# EAGLE schematic Addon-LAN-WLAN-without-MAPLE-V01-001 (EAGLE 9.3.0)
MAPLE-CUx Large Version
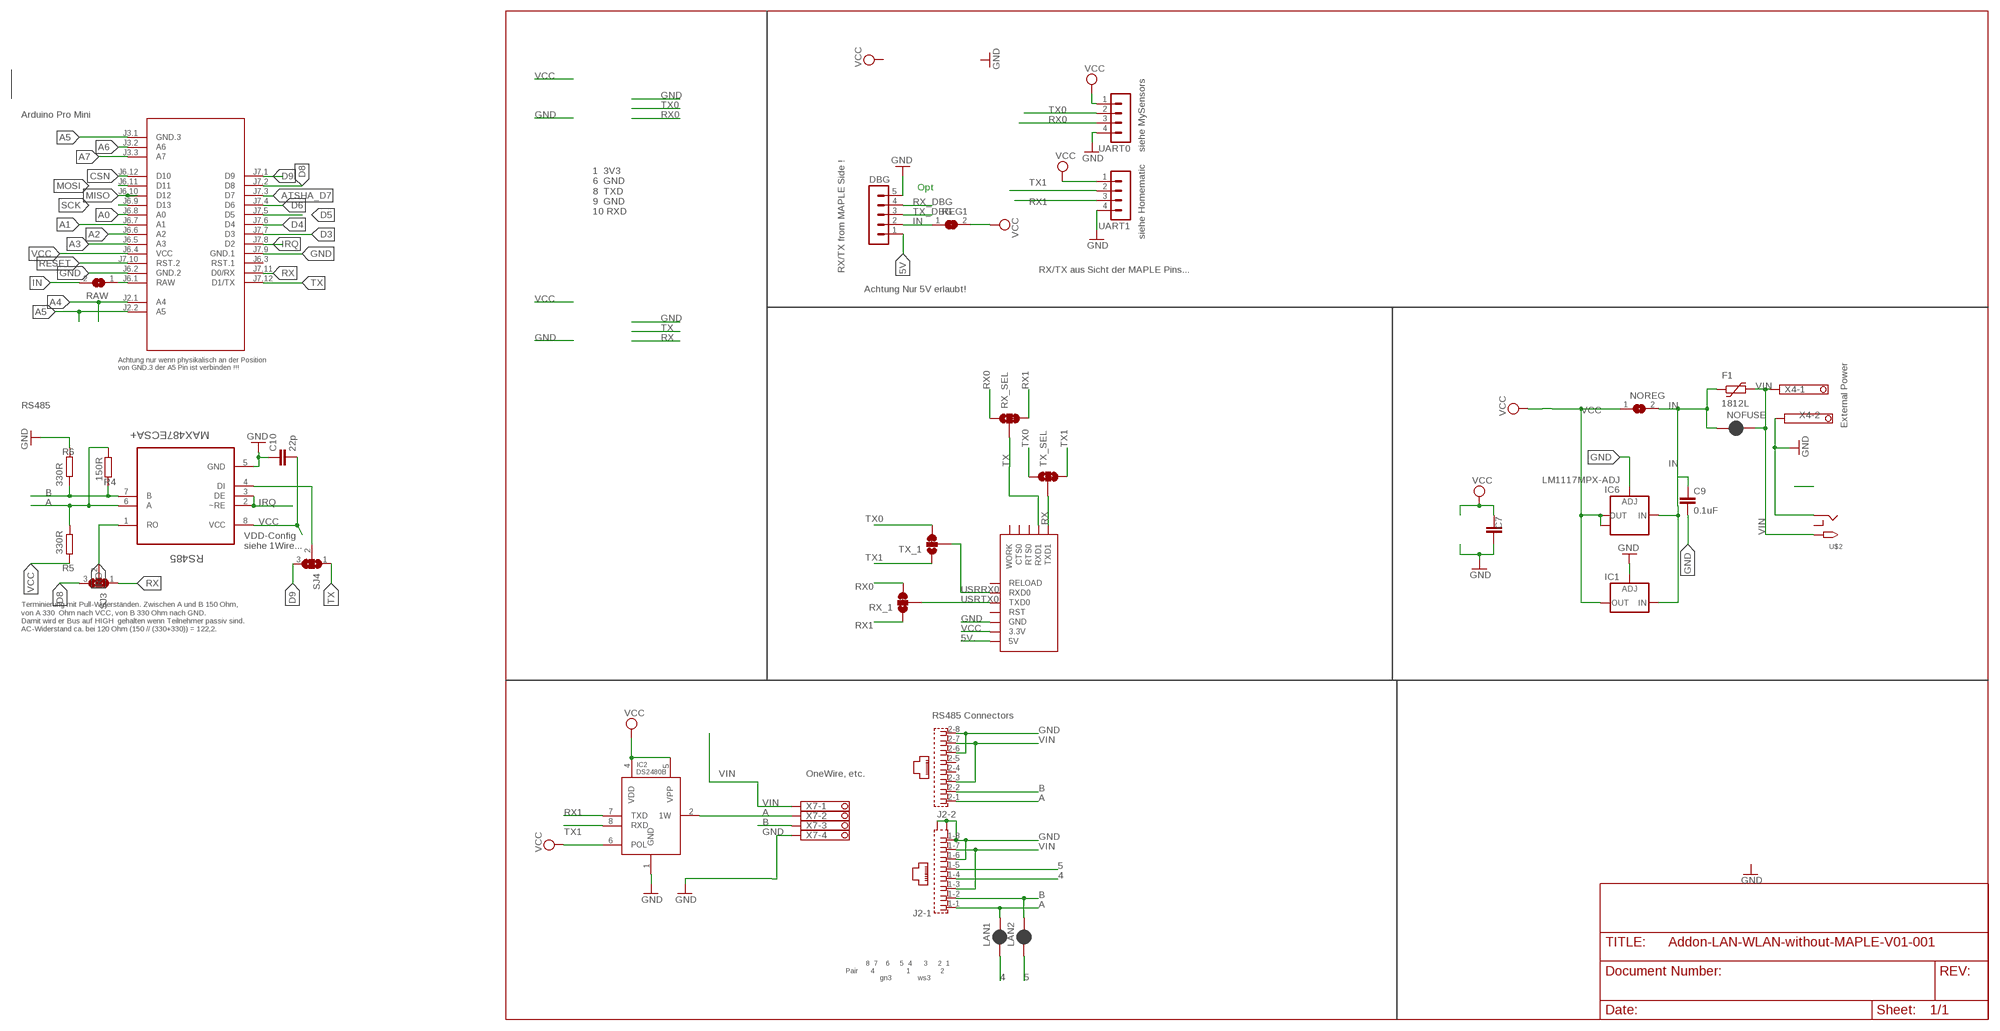
[diagram p0: schematic, sheet 1]

## Parts
C7  C-EUC1812  [C1812]
C9  0.1uF  C-EUC1206  [C1206]
C10  22p  C-EUC0805  [C0805]
DBG  MA05-1  [MA05-1]
F1  1812L  [1812L]
IC1  LD117ADT50TR  [DPACK]
IC2  DS2480B  [SO08]
IC6  LM1117MPX-ADJ  [SOT223]
J2  RJ45_2X_S  [RJ45_2X_S]
LAN1  JUMPER-SMT_2_NC_PASTE_SILK  [SMT-JUMPER_2_NC_PASTE_SILK]
LAN2  JUMPER-SMT_2_NC_PASTE_SILK  [SMT-JUMPER_2_NC_PASTE_SILK]
M1  ARDUINO-PRO-MINI-3.3V#NP  [ARDUINO-PRO-MINI#NP]
NOFUSE  JUMPER-SMT_2_NC_PASTE_NO-SILK  [SMT-JUMPER_2_NC_PASTE_NO-SILK]
NOREG  SJ  [SJ]
R4  150R  R-EU_R0805  [R0805]
R5  330R  R-EU_R0805  [R0805]
R6  330R  R-EU_R0805  [R0805]
RAW  SJ  [SJ]
REG1  SJ  [SJ]
RS485  MAX487ECSA+  [SOIC127P600X175-8N]
RX_1  JUMPER-SMT_3_1-NC_TRACE_SILK  [SMT-JUMPER_3_1-NC_TRACE_SILK]
RX_SEL  JUMPER-SMT_3_1-NC_TRACE_SILK  [SMT-JUMPER_3_1-NC_TRACE_SILK]
SJ3  SJ2W  [SJ_2]
SJ4  SJ2W  [SJ_2]
TX_1  JUMPER-SMT_3_1-NC_TRACE_SILK  [SMT-JUMPER_3_1-NC_TRACE_SILK]
TX_SEL  JUMPER-SMT_3_1-NC_TRACE_SILK  [SMT-JUMPER_3_1-NC_TRACE_SILK]
U$2  2.1MMJACKTHM  [PJ-102A]
U$5  USR-TCP232-E2  [USR-TCP232-E2]
UART0  MA04-1  [MA04-1]
UART1  MA04-1  [MA04-1]
X4  1751248  [1751248]
X7  1751264  [1751264]

## Nets
4: J2.1-4 LAN1.1
5: J2.1-5 LAN2.1
5V [PWR]: DBG.1
5V.: U$5.5V
A: IC2.2(1W) J2.1-1 J2.2-1 LAN1.2 R4.1 R5.2 RS485.6(A) X7.2
A0: M1.J6.8(A0)
A1: M1.J6.7(A1)
A2: M1.J6.6(A2)
A3: M1.J6.5(A3)
A4: M1.J2.1(A4)
A5: M1.J2.2(A5) M1.J3.1(GND.3)
A6: M1.J3.2(A6)
A7: M1.J3.3(A7)
ATSHA_D7: M1.J7.3(D7)
B: J2.1-2 J2.2-2 LAN2.2 R4.2 R6.1 RS485.7(B) X7.3
CSN: M1.J6.12(D10)
D3: M1.J7.7(D3)
D4: M1.J7.6(D4)
D5: M1.J7.5(D5)
D6: M1.J7.4(D6)
D8: M1.J7.2(D8) SJ3.3
D9: M1.J7.1(D9) SJ4.3
DI1: RS485.4(DI) SJ4.2
GND [PWR]: C7.1 C9.2 C10.1 DBG.5 IC1.1(ADJ) IC2.1(GND) IC6.1(ADJ) J2.1-6 J2.1-8 J2.2-6 J2.2-8 J2.G1(-1:S2) J2.G3(-1:S1) M1.J6.2(GND.2) M1.J7.9(GND.1) R6.2 RS485.5(GND) U$2.RING U$5.GND UART0.4 UART1.4 X4.2 X7.4
IN [PWR]: C9.1 DBG.2 F1.P$1 IC1.3(IN) IC6.3(IN) NOFUSE.1 NOREG.2 RAW.2 REG1.1
IRQ: M1.J7.8(D2) RS485.2(~RE) RS485.3(DE)
MISO: M1.J6.10(D12)
MOSI: M1.J6.11(D11)
RAW1 [PWR]: M1.J6.1(RAW) RAW.1
RESET: M1.J7.10(RST.2)
RO: RS485.1(RO) SJ3.2
RX: M1.J7.11(D0/RX) SJ3.1 TX_SEL.2 U$5.TXD1
RX0: RX_1.3 RX_SEL.1 UART0.3
RX1: IC2.7(TXD) RX_1.1 RX_SEL.3 UART1.3
RX_DBG: DBG.4
SCK: M1.J6.9(D13)
TX: M1.J7.12(D1/TX) RX_SEL.2 SJ4.1 U$5.RXD1
TX0: TX_1.3 TX_SEL.1 UART0.2
TX1: IC2.8(RXD) TX_1.1 TX_SEL.3 UART1.2
TX_DBG: DBG.3
USRRX0: TX_1.2 U$5.RXD0
USRTX0: RX_1.2 U$5.TXD0
VCC [PWR]: C7.2 C10.2 IC1.4(OUT) IC2.4(VDD) IC2.5(VPP) IC2.6(POL) IC6.2(OUT) IC6.TAB(OUT1) M1.J6.4(VCC) NOREG.1 R5.1 REG1.2 RS485.8(VCC) U$5.3.3V UART0.1 UART1.1
VIN [PWR]: F1.P$2 J2.1-3 J2.1-7 J2.2-3 J2.2-7 NOFUSE.2 U$2.TIP X4.1 X7.1
Unconnected: J2.2-4 J2.2-5 M1.J6.3(RST.1) U$2.RING_SW U$5.CTS0 U$5.RELOAD U$5.RST U$5.RTS0 U$5.WORK

## Notes on the sheet
- Arduino Pro Mini
- siehe MySensors
- Opt
- 1  3V3
  6  GND
  8  TXD
  9  GND
  10 RXD
- siehe Homematic
- RX/TX from MAPLE Side ! | RX/TX aus Sicht der MAPLE Pins...
- Achtung Nur 5V erlaubt!
- Achtung nur wenn physikalisch an der Position 
  von GND.3 der A5 Pin ist verbinden !!!
- RS485
- External Power
- VDD-Config
  siehe 1Wire...
- Terminierung mit Pull-Widerständen. Zwischen A und B 150 Ohm,
  von A 330  Ohm nach VCC, von B 330 Ohm nach GND. 
  Damit wird er Bus auf HIGH  gehalten wenn Teilnehmer passiv sind.
  AC-Widerstand ca. bei 120 Ohm (150 // (330+330)) = 122,2.
- RS485 Connectors
- OneWire, etc.
- 8  7    6     5  4      3     2  1
  Pair      4                1               2
                   gn3             ws3

## Library data of the parts
C7 C9 = rcl:C-EU: CAPACITOR, European symbol; SPICEPREFIX: C
C10 = rcl:C-EU: CAPACITOR, European symbol
DBG = con-lstb:MA05-1: PIN HEADER; OC_FARNELL: unknown; OC_NEWARK: unknown
F1 = ptc-littlefuse:1812L
IC1 = v-reg:LD117A?*: Low drop fixed and adjustable positive voltage regulators 1 A Source: http://www.st.com/stonline/products/literature/ds/7194/ld1117axx.pdf
IC2 = 1wire:DS2480B: RS232 to 1-Wire Host Adapter/Line Driver with Load Sensor This device is a onewire host and UART interface in one chip. It provides the complete DC/AC requirements for onewire communication, including overdrive speed mode and 12V EPROM programming. On the UART side, it can operate at 9.6kBaud (default), 19.2kBaud, 57.6kBaud, and 115.2kBaud. The RxD and TxD lines are operated at 0V/5V. The POL pin selects the RxD and TxD "polarity", that means straight-through or inverted. If POL is connected to GND, RxD and TxD behave properly for connection to inverted RS232 drivers, like the MC1488/1489 or MAX23x chips. If POL is connected to Vdd, RxD and TxD behave properly for direct connection to a 0V/5V UART chip. Important Notes: RxD and TxD are seen from the UART point of view, that means the DS2480B TxD pin is really an input and the DS2480B RxD pin is really an output. Vpp must be connected to 5V/Vdd if EPROM programming is not required. Vdd must be always lower than or equal to Vpp, otherwise the chip will be damaged. Best idea is to provide a separate 12V->5V/5mA voltage regulator from Vpp to Vdd if EPROM programming is required. Author: Jan Kandziora <jjj@gmx.de>
IC6 = lm1117:LM1117MPX-ADJ
J2 = RJ45:RJ45_2X_S: AMP connector
LAN1 LAN2 NOFUSE = SparkFun-Jumpers:JUMPER-SMT_2_NC_PASTE: Normally closed solder jumper This jumper has an aperture in the stencil to allow solder paste to bridge the split in the wire so it's normally closed (NC). Wick off the solder to open the connection. Reapply solder to reclose the connection.
M1 = diy-modules:ARDUINO-PRO-MINI-*#NP: Arduino Pro Mini without programming pads
NOREG RAW REG1 = jumper:SJ: SMD solder JUMPER
R4-R6 = rcl:R-EU_: RESISTOR, European symbol
RS485 = Maxim_By_element14_Batch_1:MAX487ECSA+: Low-Power, Slew-Rate-Limited RS-485/RS-422 Transceivers; MPN: MAX487ECSA+; OC_FARNELL: 9724532; OC_NEWARK: 68K4803; PACKAGE: SOIC-8; SUPPLIER: Maxim
RX_1 RX_SEL TX_1 TX_SEL = SparkFun-Jumpers:JUMPER-SMT_3_1-NC_TRACE: Normally closed trace jumper (1 of 2 connections) This jumper has a trace between two pads so it's normally closed (NC). The other connection is normally open (NO). Use a razor knife to open the connection. For best results follow the IPC guidelines for cutting traces: Cutout at least 0.063 mm (0.005 in). Remove all loose material to clean up the cut area. Seal the cut with an approved epoxy. Reapply solder to reclose the connection, or to close the NO connection.
SJ3 SJ4 = jumper:SJ2W: SMD solder JUMPER
U$2 = adafruit:2.1MMJACK: 2.1mm x 5.5mm THM DC jack with internal switch. Digikey part #PJ-102A, 4UCON part #05537 2.1mm x 5.5mm SMT DC jack with internal switch. Digikey part #PJ-002A-SMT, 4UCON part #03267 By microbuilder.eu & adafruit.com
U$5 = #Usr-tcp232:USR-TCP232-E2
UART0 UART1 = con-lstb:MA04-1: PIN HEADER; OC_FARNELL: unknown; OC_NEWARK: unknown
X4 = con-phoenix-350:1751248: MKDS 1/ 2-3,5 Printklemme Nennstrom: 10 A Bemessungsspannung: 160 V Raster: 3,5 mm Polzahl: 2 Montageart: Löten Anschlussart: Schraubanschluss Anschlussrichtung vom Leiter zur Platine: 0° Source: http://eshop.phoenixcontact.com .. 1751248.pdf; OC_FARNELL: unknown; OC_NEWARK: unknown
X7 = con-phoenix-350:1751264: MKDS 1/ 4-3,5 Printklemme Nennstrom: 10 A Bemessungsspannung: 160 V Raster: 3,5 mm Polzahl: 4 Montageart: Löten Anschlussart: Schraubanschluss Anschlussrichtung vom Leiter zur Platine: 0° Source: http://eshop.phoenixcontact.com .. 1751264.pdf; MPN: 1751264; OC_FARNELL: unknown; OC_NEWARK: 10R0934

## Net classes
0 default: width 0.305 mm
1 PWR: width 0.61 mm